# Altium schematic sheet PMIC.SchDoc
size A4; Organization: My Company; Address1: Address Line 1; Address2: Address Line 2; Address3: Address Line 3; Address4: Address Line 4; SheetNumber: 6; SheetTotal: 7
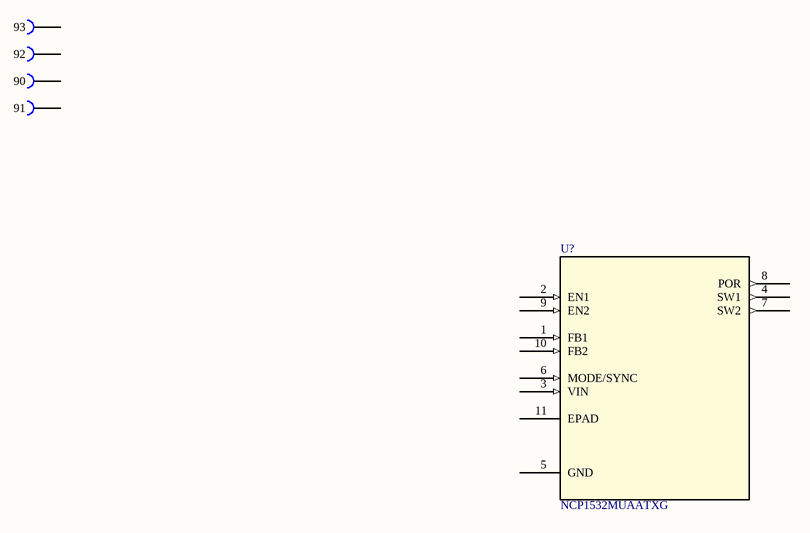
[diagram p0: PMIC.SchDoc]

## Parts
(Parts that share a designator on the sheet are numbered #1, #2 ... from top to bottom, then left to right.)
i.MX?#1  i.MX6_SoM  [i.MX6_SoM]  (value not drawn)  (part 93 of 159)  (no BOM)
i.MX?#2  i.MX6_SoM  [i.MX6_SoM]  (value not drawn)  (part 92 of 159)  (no BOM)
i.MX?#3  i.MX6_SoM  [i.MX6_SoM]  (value not drawn)  (part 90 of 159)  (no BOM)
i.MX?#4  i.MX6_SoM  [i.MX6_SoM]  (value not drawn)  (part 91 of 159)  (no BOM)
U?  NCP1532MUAATXG  [UDFN10_3X3_ONS]

## Nets

Not connected (* = marked no-connect by the designer): i.MX?#1 93; i.MX?#2 92; i.MX?#3 90; i.MX?#4 91; U? 1(FB1) 2(EN1) 3(VIN) 4(SW1) 5(GND) 6(MODE/SYNC) 7(SW2) 8(POR) 9(EN2) 10(FB2) 11(EPAD)

## Notes on the sheet
- Title:
- Author:
- Approved:
- Size:
- Date:
- Git Hash:
- A4
- Prj:
- SW Version:
- Variant:
- Edited:
- CONFIDENTIAL
- File:

## Library data of the parts
U? = NCP1532MUAATXG: No Description Available; SourceLibrary: ON_Semiconductor_2018-03-21; Built_By: EMA_Jessica; Vendor: ON Semiconductor; Copyright: Copyright (C) 2016 Accelerated Designs. All rights reserved; Manufacturer_Part_Number: NCP1532MUAATXG; RefDes: RefDes; Type: DEV